# EAGLE design SERVICES_1 (EAGLE 6.5.0)

## Sheet 1 of 4
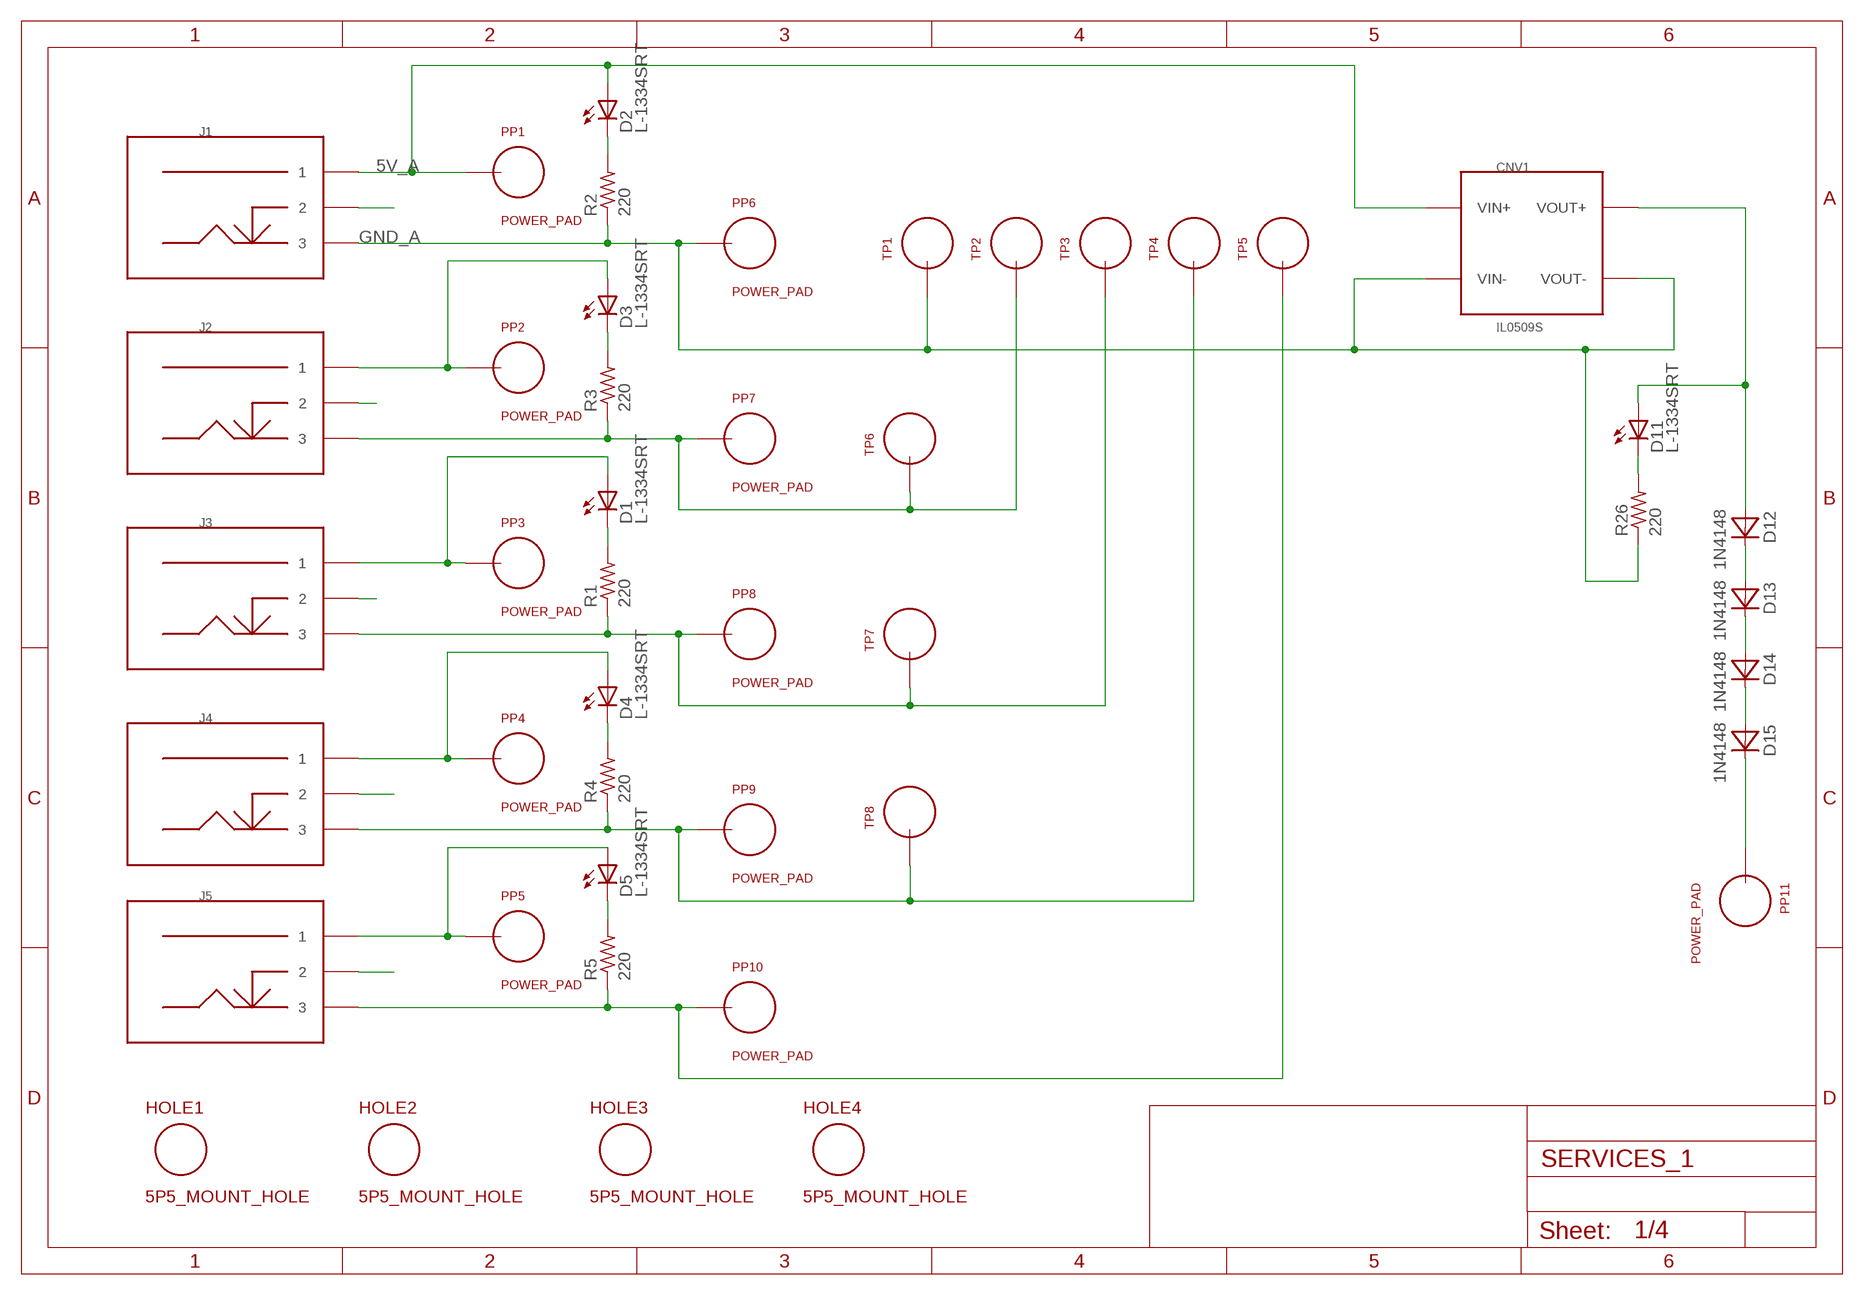
[diagram p0: schematic, sheet 1]

### Parts
CNV1  IL0509S  [SIL_IL]
D1  L-1334SRT  [LED3MM]
D2  L-1334SRT  [LED3MM]
D3  L-1334SRT  [LED3MM]
D4  L-1334SRT  [LED3MM]
D5  L-1334SRT  [LED3MM]
D11  L-1334SRT  [LED3MM]
D12  1N4148  [DO34-5]
D13  1N4148  [DO34-5]
D14  1N4148  [DO34-5]
D15  1N4148  [DO34-5]
HOLE1  5P5_MOUNT_HOLE  [5P5M_HOLE]
HOLE2  5P5_MOUNT_HOLE  [5P5M_HOLE]
HOLE3  5P5_MOUNT_HOLE  [5P5M_HOLE]
HOLE4  5P5_MOUNT_HOLE  [5P5M_HOLE]
J1  POWER_ENTRY  [POWER_25]
J2  POWER_ENTRY  [POWER_25]
J3  POWER_ENTRY  [POWER_25]
J4  POWER_ENTRY  [POWER_25]
J5  POWER_ENTRY  [POWER_25]
PP1  POWER_PAD  [POWER_PAD]
PP2  POWER_PAD  [POWER_PAD]
PP3  POWER_PAD  [POWER_PAD]
PP4  POWER_PAD  [POWER_PAD]
PP5  POWER_PAD  [POWER_PAD]
PP6  POWER_PAD  [POWER_PAD]
PP7  POWER_PAD  [POWER_PAD]
PP8  POWER_PAD  [POWER_PAD]
PP9  POWER_PAD  [POWER_PAD]
PP10  POWER_PAD  [POWER_PAD]
PP11  POWER_PAD  [POWER_PAD]
R1  220  R_P2INCH  [R_P2INCH]
R2  220  R_P2INCH  [R_P2INCH]
R3  220  R_P2INCH  [R_P2INCH]
R4  220  R_P2INCH  [R_P2INCH]
R5  220  R_P2INCH  [R_P2INCH]
R26  220  R_P2INCH  [R_P2INCH]
TP1  TEST_LOOP  [TEST_LOOP]
TP2  TEST_LOOP  [TEST_LOOP]
TP3  TEST_LOOP  [TEST_LOOP]
TP4  TEST_LOOP  [TEST_LOOP]
TP5  TEST_LOOP  [TEST_LOOP]
TP6  TEST_LOOP  [TEST_LOOP]
TP7  TEST_LOOP  [TEST_LOOP]
TP8  TEST_LOOP  [TEST_LOOP]

### Nets
5V_A: CNV1.VIN+ D2.A J1.1 PP1.1 ; also sheet 2
GND_A: CNV1.VIN- CNV1.VOUT- J1.3 PP6.1 R2.1 R26.1 TP1.P$1 ; also sheet 2,3,4
N$2: D3.A J2.1 PP2.1
N$3: D1.A J3.1 PP3.1
N$4: D4.A J4.1 PP4.1
N$5: D5.A J5.1 PP5.1
N$7: J2.3 PP7.1 R3.1 TP2.P$1 TP6.P$1
N$8: J3.3 PP8.1 R1.1 TP3.P$1 TP7.P$1
N$9: J4.3 PP9.1 R4.1 TP4.P$1 TP8.P$1
N$10: J5.3 PP10.1 R5.1 TP5.P$1
N$11: CNV1.VOUT+ D11.A D12.A
N$13: D1.K(C) R1.2
N$14: D2.K(C) R2.2
N$15: D3.K(C) R3.2
N$16: D4.K(C) R4.2
N$17: D5.K(C) R5.2
N$23: D11.K(C) R26.2
N$36: D12.C D13.A
N$37: J1.2
N$38: J2.2
N$39: J3.2
N$40: J4.2
N$41: J5.2
N$53: D13.C D14.A
N$70: D14.C D15.A
N$87: D15.C PP11.1

## Sheet 2 of 4
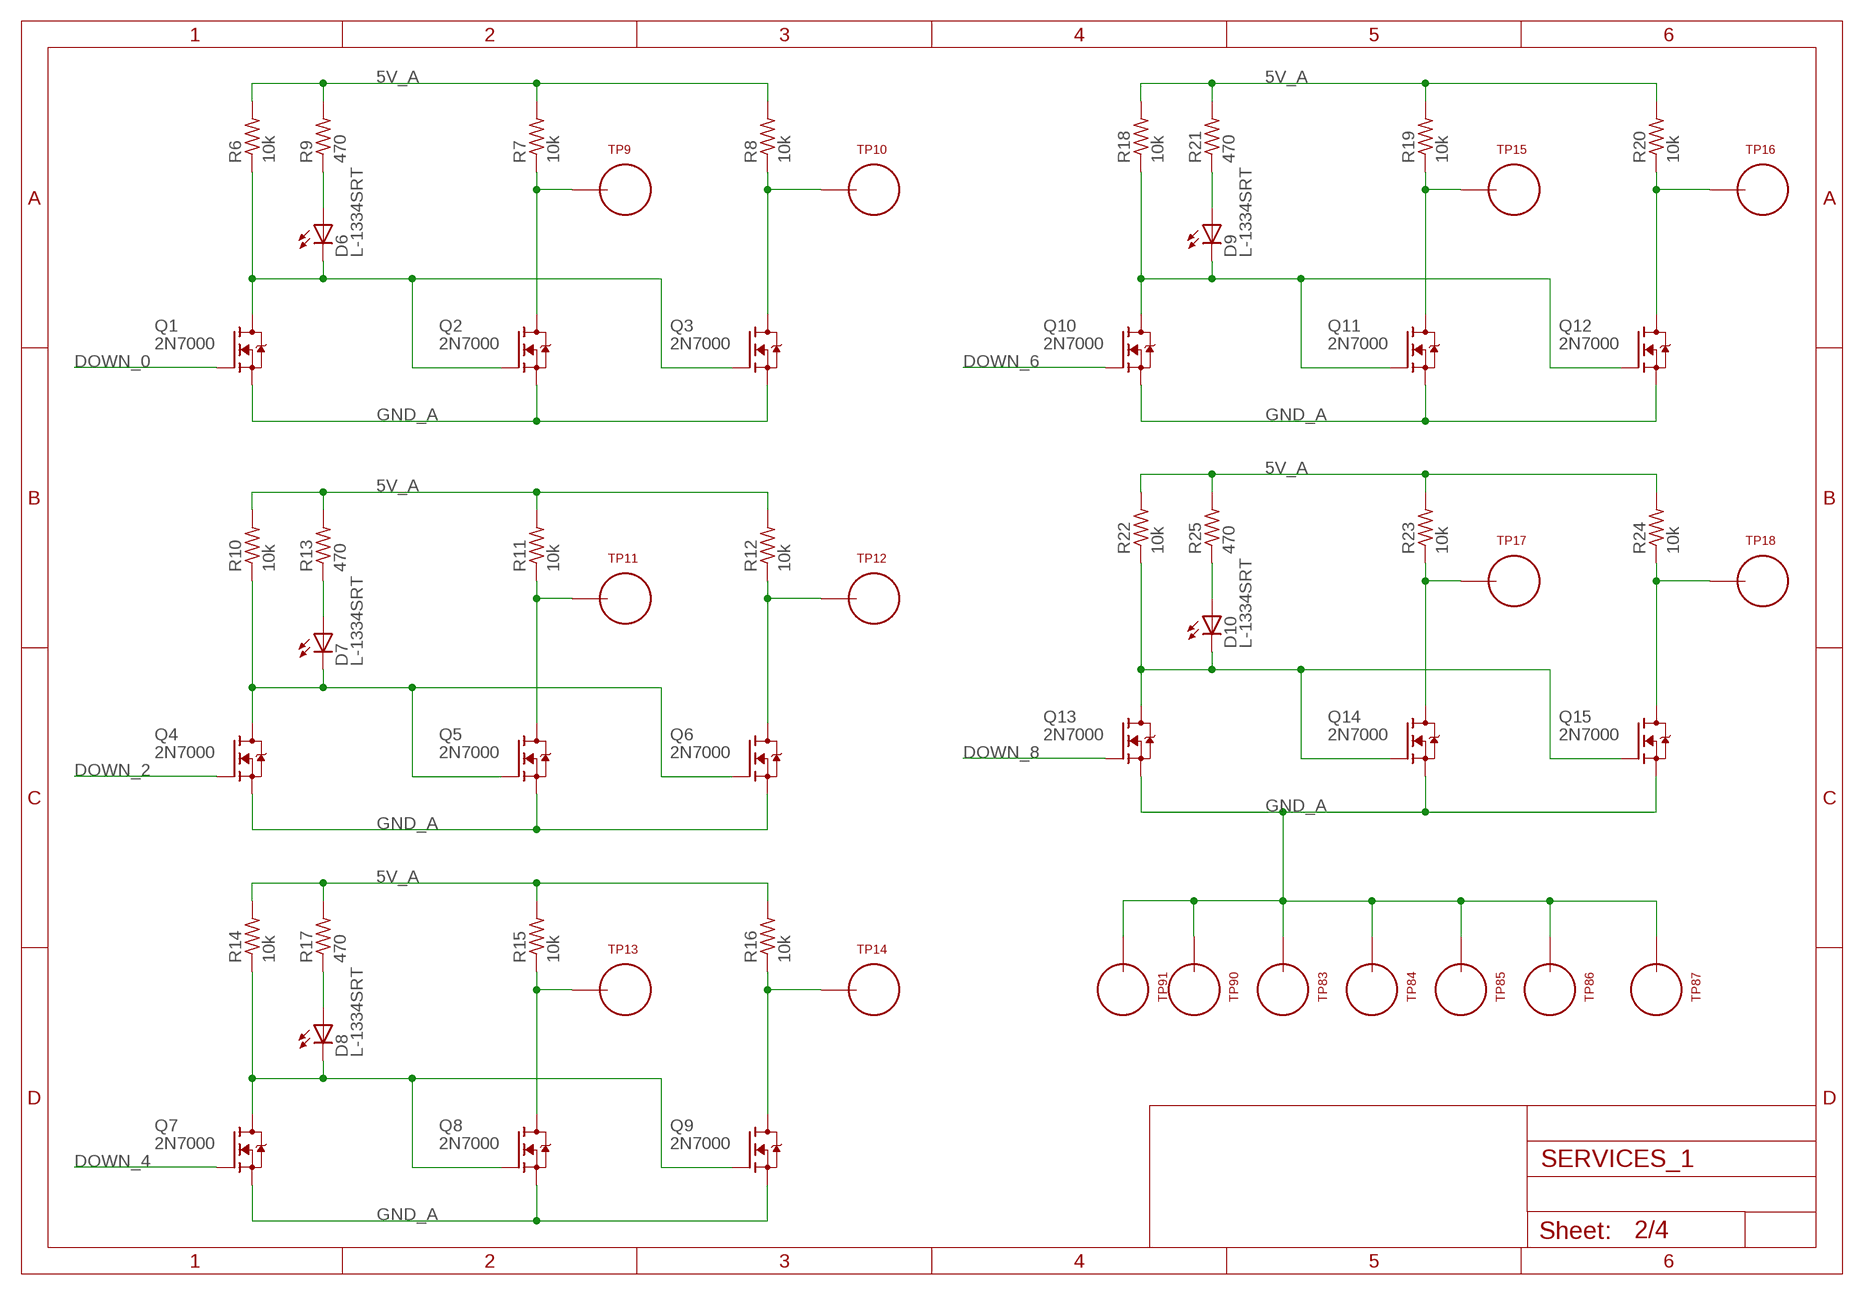
[diagram p1: schematic, sheet 2]

### Parts
D6  L-1334SRT  [LED3MM]
D7  L-1334SRT  [LED3MM]
D8  L-1334SRT  [LED3MM]
D9  L-1334SRT  [LED3MM]
D10  L-1334SRT  [LED3MM]
Q1  2N7000  [TO92-DGS]
Q2  2N7000  [TO92-DGS]
Q3  2N7000  [TO92-DGS]
Q4  2N7000  [TO92-DGS]
Q5  2N7000  [TO92-DGS]
Q6  2N7000  [TO92-DGS]
Q7  2N7000  [TO92-DGS]
Q8  2N7000  [TO92-DGS]
Q9  2N7000  [TO92-DGS]
Q10  2N7000  [TO92-DGS]
Q11  2N7000  [TO92-DGS]
Q12  2N7000  [TO92-DGS]
Q13  2N7000  [TO92-DGS]
Q14  2N7000  [TO92-DGS]
Q15  2N7000  [TO92-DGS]
R6  10k  R_P2INCH  [R_P2INCH]
R7  10k  R_P2INCH  [R_P2INCH]
R8  10k  R_P2INCH  [R_P2INCH]
R9  470  R_P2INCH  [R_P2INCH]
R10  10k  R_P2INCH  [R_P2INCH]
R11  10k  R_P2INCH  [R_P2INCH]
R12  10k  R_P2INCH  [R_P2INCH]
R13  470  R_P2INCH  [R_P2INCH]
R14  10k  R_P2INCH  [R_P2INCH]
R15  10k  R_P2INCH  [R_P2INCH]
R16  10k  R_P2INCH  [R_P2INCH]
R17  470  R_P2INCH  [R_P2INCH]
R18  10k  R_P2INCH  [R_P2INCH]
R19  10k  R_P2INCH  [R_P2INCH]
R20  10k  R_P2INCH  [R_P2INCH]
R21  470  R_P2INCH  [R_P2INCH]
R22  10k  R_P2INCH  [R_P2INCH]
R23  10k  R_P2INCH  [R_P2INCH]
R24  10k  R_P2INCH  [R_P2INCH]
R25  470  R_P2INCH  [R_P2INCH]
TP9  TEST_LOOP  [TEST_LOOP]
TP10  TEST_LOOP  [TEST_LOOP]
TP11  TEST_LOOP  [TEST_LOOP]
TP12  TEST_LOOP  [TEST_LOOP]
TP13  TEST_LOOP  [TEST_LOOP]
TP14  TEST_LOOP  [TEST_LOOP]
TP15  TEST_LOOP  [TEST_LOOP]
TP16  TEST_LOOP  [TEST_LOOP]
TP17  TEST_LOOP  [TEST_LOOP]
TP18  TEST_LOOP  [TEST_LOOP]
TP83  TEST_LOOP  [TEST_LOOP]
TP84  TEST_LOOP  [TEST_LOOP]
TP85  TEST_LOOP  [TEST_LOOP]
TP86  TEST_LOOP  [TEST_LOOP]
TP87  TEST_LOOP  [TEST_LOOP]
TP90  TEST_LOOP  [TEST_LOOP]
TP91  TEST_LOOP  [TEST_LOOP]

### Nets
5V_A: R6.2 R7.2 R8.2 R9.2 R10.2 R11.2 R12.2 R13.2 R14.2 R15.2 R16.2 R17.2 R18.2 R19.2 R20.2 R21.2 R22.2 R23.2 R24.2 R25.2 ; also sheet 1
DOWN_0: Q1.G ; also sheet 3
DOWN_2: Q4.G ; also sheet 3
DOWN_4: Q7.G ; also sheet 3
DOWN_6: Q10.G ; also sheet 3
DOWN_8: Q13.G ; also sheet 3
GND_A: Q1.S Q2.S Q3.S Q4.S Q5.S Q6.S Q7.S Q8.S Q9.S Q10.S Q11.S Q12.S Q13.S Q14.S Q15.S TP83.P$1 TP84.P$1 TP85.P$1 TP86.P$1 TP87.P$1 TP90.P$1 TP91.P$1 ; also sheet 1,3,4
N$1: D7.A R13.1
N$6: Q5.D R11.1 TP11.P$1
N$12: Q6.D R12.1 TP12.P$1
N$18: D6.A R9.1
N$19: Q2.D R7.1 TP9.P$1
N$20: Q3.D R8.1 TP10.P$1
N$21: D6.K(C) Q1.D Q2.G Q3.G R6.1
N$22: D7.K(C) Q4.D Q5.G Q6.G R10.1
N$24: D8.A R17.1
N$25: Q8.D R15.1 TP13.P$1
N$26: Q9.D R16.1 TP14.P$1
N$27: D8.K(C) Q7.D Q8.G Q9.G R14.1
N$28: D9.A R21.1
N$29: Q11.D R19.1 TP15.P$1
N$30: Q12.D R20.1 TP16.P$1
N$31: D9.K(C) Q10.D Q11.G Q12.G R18.1
N$32: D10.A R25.1
N$33: Q14.D R23.1 TP17.P$1
N$34: Q15.D R24.1 TP18.P$1
N$35: D10.K(C) Q13.D Q14.G Q15.G R22.1

## Sheet 3 of 4
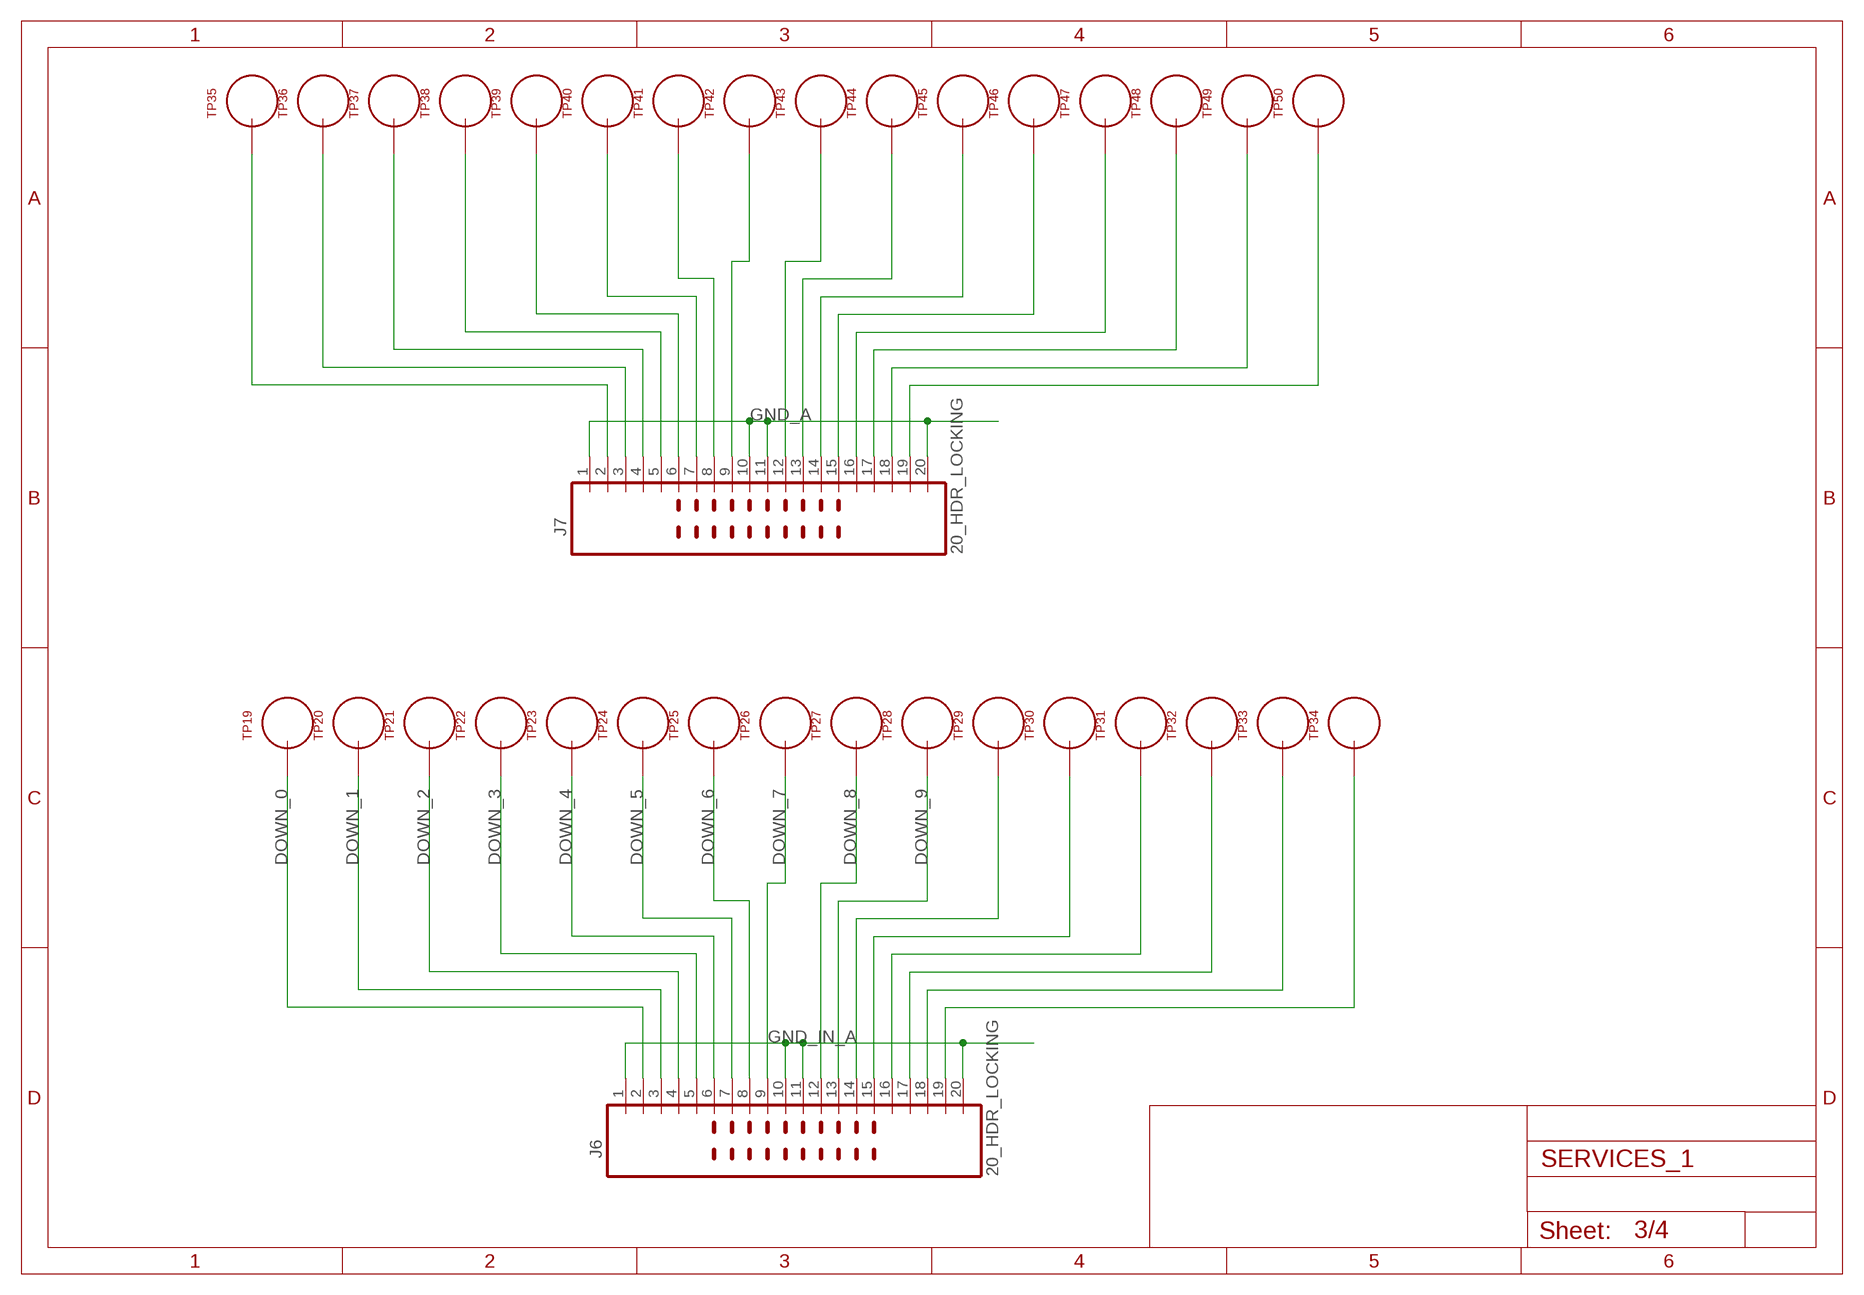
[diagram p2: schematic, sheet 3]

### Parts
J6  20_HDR_LOCKING  [20_HDR_LOCKING]
J7  20_HDR_LOCKING  [20_HDR_LOCKING]
TP19  TEST_LOOP  [TEST_LOOP]
TP20  TEST_LOOP  [TEST_LOOP]
TP21  TEST_LOOP  [TEST_LOOP]
TP22  TEST_LOOP  [TEST_LOOP]
TP23  TEST_LOOP  [TEST_LOOP]
TP24  TEST_LOOP  [TEST_LOOP]
TP25  TEST_LOOP  [TEST_LOOP]
TP26  TEST_LOOP  [TEST_LOOP]
TP27  TEST_LOOP  [TEST_LOOP]
TP28  TEST_LOOP  [TEST_LOOP]
TP29  TEST_LOOP  [TEST_LOOP]
TP30  TEST_LOOP  [TEST_LOOP]
TP31  TEST_LOOP  [TEST_LOOP]
TP32  TEST_LOOP  [TEST_LOOP]
TP33  TEST_LOOP  [TEST_LOOP]
TP34  TEST_LOOP  [TEST_LOOP]
TP35  TEST_LOOP  [TEST_LOOP]
TP36  TEST_LOOP  [TEST_LOOP]
TP37  TEST_LOOP  [TEST_LOOP]
TP38  TEST_LOOP  [TEST_LOOP]
TP39  TEST_LOOP  [TEST_LOOP]
TP40  TEST_LOOP  [TEST_LOOP]
TP41  TEST_LOOP  [TEST_LOOP]
TP42  TEST_LOOP  [TEST_LOOP]
TP43  TEST_LOOP  [TEST_LOOP]
TP44  TEST_LOOP  [TEST_LOOP]
TP45  TEST_LOOP  [TEST_LOOP]
TP46  TEST_LOOP  [TEST_LOOP]
TP47  TEST_LOOP  [TEST_LOOP]
TP48  TEST_LOOP  [TEST_LOOP]
TP49  TEST_LOOP  [TEST_LOOP]
TP50  TEST_LOOP  [TEST_LOOP]

### Nets
DOWN_0: J6.2 TP19.P$1 ; also sheet 2
DOWN_1: J6.3 TP20.P$1
DOWN_2: J6.4 TP21.P$1 ; also sheet 2
DOWN_3: J6.5 TP22.P$1
DOWN_4: J6.6 TP23.P$1 ; also sheet 2
DOWN_5: J6.7 TP24.P$1
DOWN_6: J6.8 TP25.P$1 ; also sheet 2
DOWN_7: J6.9 TP26.P$1
DOWN_8: J6.12 TP27.P$1 ; also sheet 2
DOWN_9: J6.13 TP28.P$1
GND_A: J7.1 J7.10 J7.11 J7.20 ; also sheet 1,2,4
GND_IN_A: J6.1 J6.10 J6.11 J6.20
N$44: J6.19 TP34.P$1
N$45: J6.18 TP33.P$1
N$46: J6.17 TP32.P$1
N$47: J6.16 TP31.P$1
N$48: J6.15 TP30.P$1
N$49: J6.14 TP29.P$1
N$54: J7.2 TP35.P$1
N$55: J7.3 TP36.P$1
N$56: J7.4 TP37.P$1
N$57: J7.5 TP38.P$1
N$58: J7.6 TP39.P$1
N$59: J7.7 TP40.P$1
N$60: J7.8 TP41.P$1
N$61: J7.19 TP50.P$1
N$62: J7.18 TP49.P$1
N$63: J7.17 TP48.P$1
N$64: J7.16 TP47.P$1
N$65: J7.15 TP46.P$1
N$66: J7.14 TP45.P$1
N$67: J7.13 TP44.P$1
N$68: J7.12 TP43.P$1
N$69: J7.9 TP42.P$1

## Sheet 4 of 4
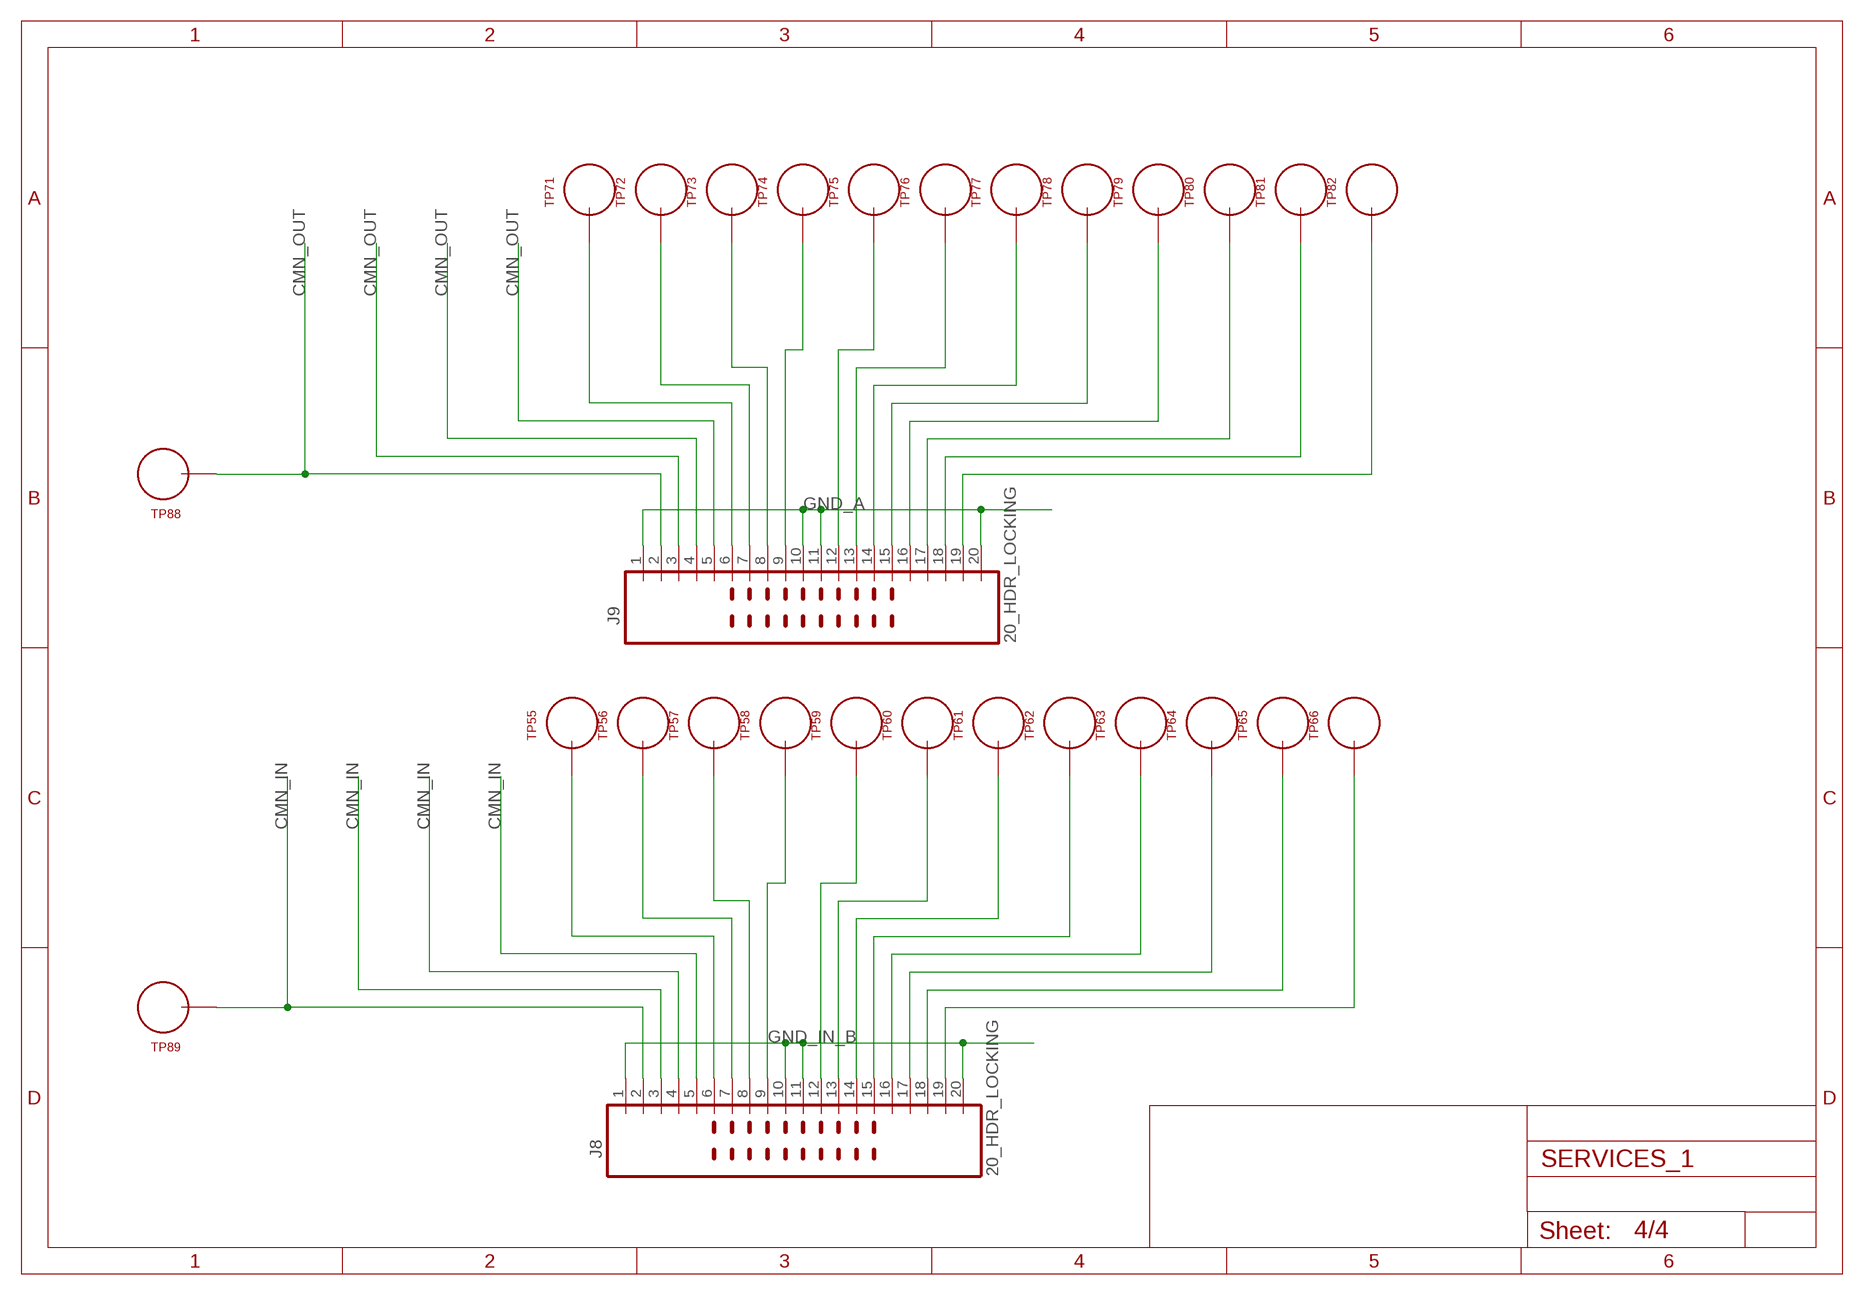
[diagram p3: schematic, sheet 4]

### Parts
J8  20_HDR_LOCKING  [20_HDR_LOCKING]
J9  20_HDR_LOCKING  [20_HDR_LOCKING]
TP55  TEST_LOOP  [TEST_LOOP]
TP56  TEST_LOOP  [TEST_LOOP]
TP57  TEST_LOOP  [TEST_LOOP]
TP58  TEST_LOOP  [TEST_LOOP]
TP59  TEST_LOOP  [TEST_LOOP]
TP60  TEST_LOOP  [TEST_LOOP]
TP61  TEST_LOOP  [TEST_LOOP]
TP62  TEST_LOOP  [TEST_LOOP]
TP63  TEST_LOOP  [TEST_LOOP]
TP64  TEST_LOOP  [TEST_LOOP]
TP65  TEST_LOOP  [TEST_LOOP]
TP66  TEST_LOOP  [TEST_LOOP]
TP71  TEST_LOOP  [TEST_LOOP]
TP72  TEST_LOOP  [TEST_LOOP]
TP73  TEST_LOOP  [TEST_LOOP]
TP74  TEST_LOOP  [TEST_LOOP]
TP75  TEST_LOOP  [TEST_LOOP]
TP76  TEST_LOOP  [TEST_LOOP]
TP77  TEST_LOOP  [TEST_LOOP]
TP78  TEST_LOOP  [TEST_LOOP]
TP79  TEST_LOOP  [TEST_LOOP]
TP80  TEST_LOOP  [TEST_LOOP]
TP81  TEST_LOOP  [TEST_LOOP]
TP82  TEST_LOOP  [TEST_LOOP]
TP88  TEST_LOOP  [TEST_LOOP]
TP89  TEST_LOOP  [TEST_LOOP]

### Nets
CMN_IN: J8.2 J8.3 J8.4 J8.5 TP89.P$1
CMN_OUT: J9.2 J9.3 J9.4 J9.5 TP88.P$1
GND_A: J9.1 J9.10 J9.11 J9.20 ; also sheet 1,2,3
GND_IN_B: J8.1 J8.10 J8.11 J8.20
N$75: J8.6 TP55.P$1
N$76: J8.7 TP56.P$1
N$77: J8.8 TP57.P$1
N$78: J8.19 TP66.P$1
N$79: J8.18 TP65.P$1
N$80: J8.17 TP64.P$1
N$81: J8.16 TP63.P$1
N$82: J8.15 TP62.P$1
N$83: J8.14 TP61.P$1
N$84: J8.13 TP60.P$1
N$85: J8.12 TP59.P$1
N$86: J8.9 TP58.P$1
N$92: J9.6 TP71.P$1
N$93: J9.7 TP72.P$1
N$94: J9.8 TP73.P$1
N$95: J9.19 TP82.P$1
N$96: J9.18 TP81.P$1
N$97: J9.17 TP80.P$1
N$98: J9.16 TP79.P$1
N$99: J9.15 TP78.P$1
N$100: J9.14 TP77.P$1
N$101: J9.13 TP76.P$1
N$102: J9.12 TP75.P$1
N$103: J9.9 TP74.P$1

## Library data of the parts
CNV1 = MyLib:IL0509S
D1-D11 = MyLib:L-1334SRT
D12-D15 = james:1N4148
HOLE1-HOLE4 = MyLib:5P5_MOUNT_HOLE
J1-J5 = MyLib:POWER_ENTRY
J6-J9 = MyLib:20_HDR_LOCKING
PP1-PP11 = MyLib:POWER_PAD
Q1-Q15 = MyLib:2N7000
R1-R26 = MyLib:R_P2INCH
TP1-TP50 TP55-TP66 TP71-TP91 = MyLib:TEST_LOOP

## Board
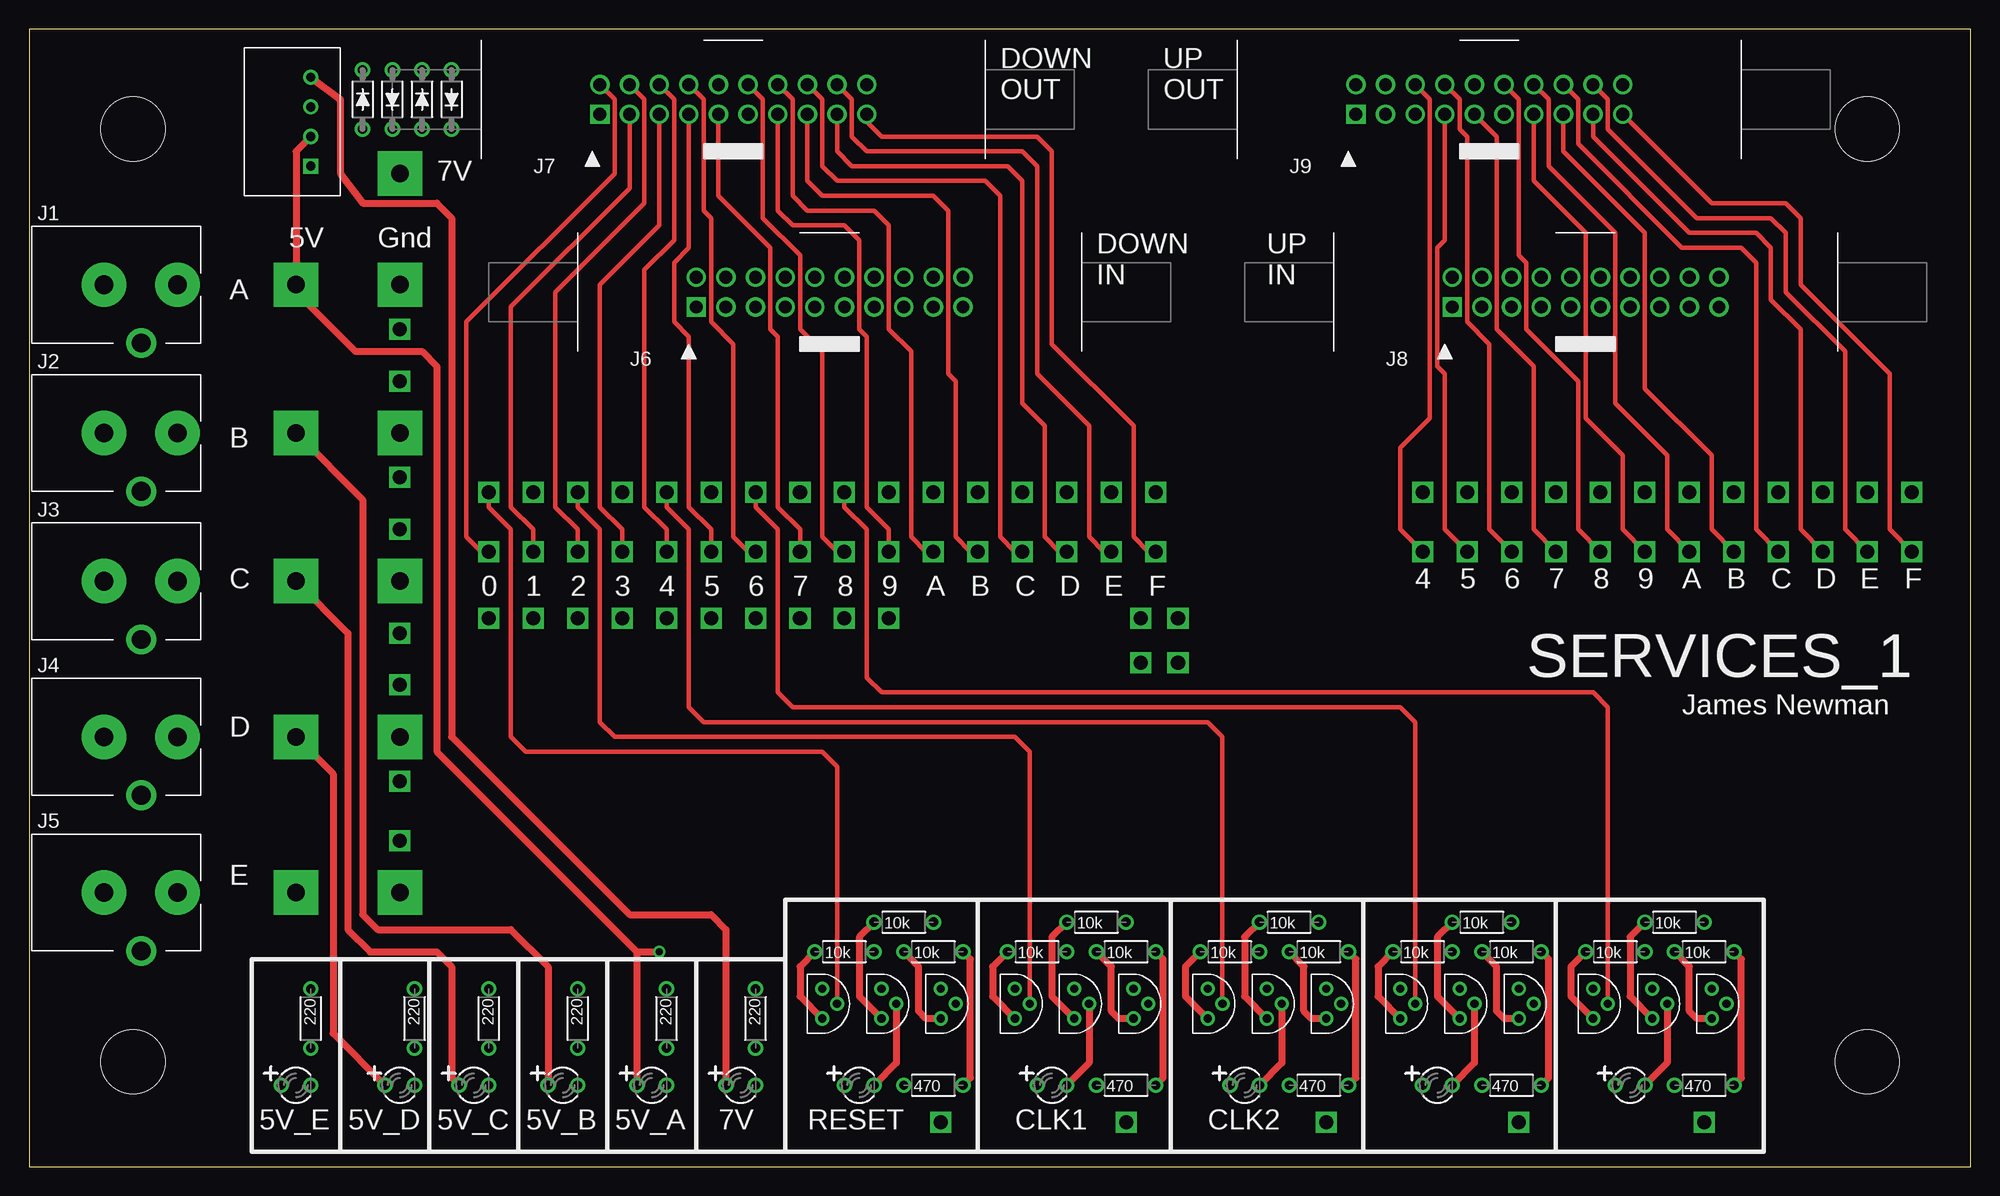
[diagram p4: board, top side]
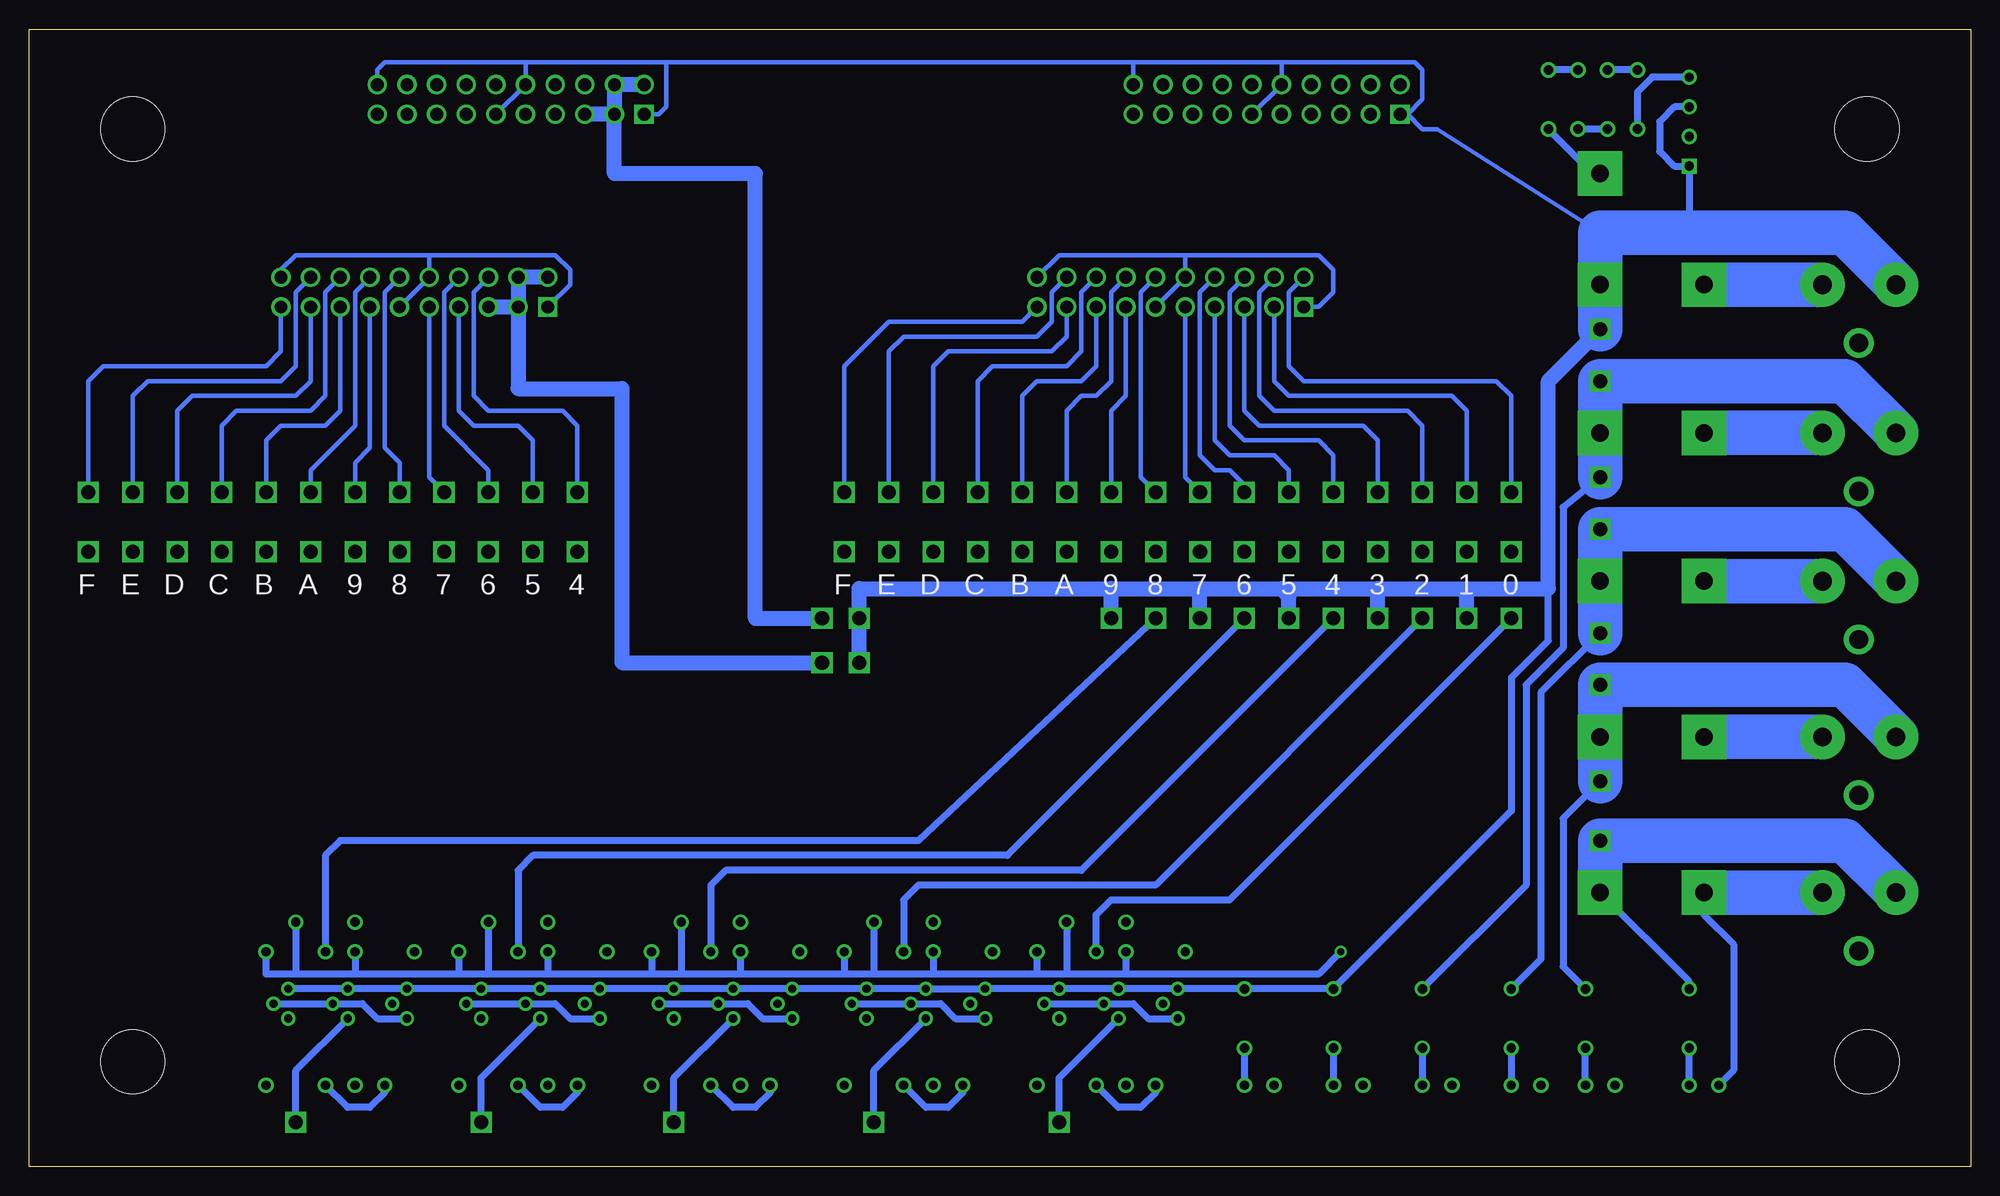
[diagram p5: board, bottom side, seen from below]

Size 166.35 x 97.46 mm. Coordinates in mm from the lower left corner, seen from the top.
Outline: 0,0 166.35,0 166.35,97.46 0,97.46 0,0
Copper layers (1*16): Top 0.035mm / dielectric 1.5mm / Bottom 0.035mm
Design rules "processor_rules_2layer": minimum track width 8mil, minimum drill 14mil, track to track 8mil, track to pad 8mil, pad to pad 8mil, via to via 8mil, smd to smd 8mil, copper to edge 40mil, drill to drill 8mil, minimum pad ring 10mil, minimum via ring 8mil, stop-mask expansion 4mil, vias tented up to drill 0.7mm, thermal gap 10mil

### Footprints (pad centres in the part's own frame; a part is rotated, then mirrored left to right if it is on the bottom)
SIL_IL = drill 0.8: VIN+ -1.27,-2.54; VOUT+ 3.81,-2.54; VOUT- 1.27,-2.54 | drill 0.8 square: VIN- -3.81,-2.54
LED3MM = drill 0.8: A -1.27,0; K 1.27,0
DO34-5 = drill 0.813: A 2.54,0; C -2.54,0
5P5M_HOLE = hole 5.5: 0,0
POWER_25 = drill 1.6 pad 3.81: 1 0,0; 3 -6.3,0 | drill 1.6 pad 2.54: 2 -3.1,-5
20_HDR_LOCKING = drill 1.1 square: 1 -1.27,11.43 | drill 1.1: 2 1.27,11.43; 3 -1.27,8.89; 4 1.27,8.89; 5 -1.27,6.35; 6 1.27,6.35; 7 -1.27,3.81; 8 1.27,3.81; 9 -1.27,1.27; 10 1.27,1.27; 11 -1.27,-1.27; 12 1.27,-1.27; 13 -1.27,-3.81; 14 1.27,-3.81; 15 -1.27,-6.35; 16 1.27,-6.35; 17 -1.27,-8.89; 18 1.27,-8.89; 19 -1.27,-11.43; 20 1.27,-11.43
POWER_PAD = drill 1.5 pad 3.81 square: 1 0,0
TO92-DGS = drill 0.7: D 0,1.27; G -1.27,0; S 0,-1.27
R_P2INCH = drill 0.8: 1 -2.54,0; 2 2.54,0
TEST_LOOP = drill 1.2 square: P$1 0,0

### Placement (x,y rotation side)
CNV1  21.59,89.53 90 top
D1  38.1,6.99 0 top
D2  53.34,6.99 0 top
D3  45.72,6.99 0 top
D4  31.75,6.99 0 top
D5  22.86,6.99 0 top
D6  71.12,6.99 0 top
D7  87.63,6.99 0 top
D8  104.14,6.99 0 top
D9  120.65,6.99 0 top
D10  137.16,6.99 0 top
D11  60.96,6.99 0 top
D12  28.57,91.44 270 top
D13  31.11,91.44 90 top
D14  33.66,91.44 270 top
D15  36.2,91.44 90 top
HOLE1  157.48,88.9 0 top
HOLE2  157.48,8.99 0 top
HOLE3  8.89,8.99 0 top
HOLE4  8.89,88.9 0 top
J1  12.7,75.56 0 top
J2  12.7,62.87 0 top
J3  12.7,50.16 0 top
J4  12.7,36.83 0 top
J5  12.7,23.5 0 top
J6  68.58,74.93 90 top
J7  60.33,91.44 90 top
J8  133.35,74.93 90 top
J9  125.09,91.44 90 top
PP1  22.86,75.56 270 top
PP2  22.86,62.87 270 top
PP3  22.86,50.16 270 top
PP4  22.86,36.83 270 top
PP5  22.86,23.5 270 top
PP6  31.75,75.56 270 top
PP7  31.75,62.87 270 top
PP8  31.75,50.16 270 top
PP9  31.75,36.83 270 top
PP10  31.75,23.5 270 top
PP11  31.75,85.09 270 top
Q1  67.94,13.97 180 top
Q2  73.03,13.97 180 top
Q3  78.11,13.97 180 top
Q4  84.45,13.97 180 top
Q5  89.53,13.97 180 top
Q6  94.61,13.97 180 top
Q7  100.97,13.97 180 top
Q8  106.05,13.97 180 top
Q9  111.12,13.97 180 top
Q10  117.47,13.97 180 top
Q11  122.56,13.97 180 top
Q12  127.64,13.97 180 top
Q13  133.99,13.97 180 top
Q14  139.06,13.97 180 top
Q15  144.15,13.97 180 top
R1  39.37,12.7 270 top
R2  54.61,12.7 270 top
R3  46.99,12.7 270 top
R4  33.02,12.7 270 top
R5  24.13,12.7 270 top
R6  69.85,18.41 0 top
R7  74.93,20.95 0 top
R8  77.47,18.41 0 top
R9  77.47,6.99 0 top
R10  86.36,18.41 0 top
R11  91.44,20.95 0 top
R12  93.98,18.41 0 top
R13  93.98,6.99 0 top
R14  102.87,18.41 0 top
R15  107.95,20.95 0 top
R16  110.49,18.41 0 top
R17  110.49,6.99 0 top
R18  119.38,18.41 0 top
R19  124.46,20.95 0 top
R20  127,18.41 0 top
R21  127,6.99 0 top
R22  135.89,18.41 0 top
R23  140.97,20.95 0 top
R24  143.51,18.41 0 top
R25  143.51,6.99 0 top
R26  62.23,12.7 270 top
TP1  31.75,71.75 90 top
TP2  31.75,59.05 90 top
TP3  31.75,54.61 90 top
TP4  31.75,33.02 90 top
TP5  31.75,27.94 90 top
TP6  31.75,67.31 90 top
TP7  31.75,45.72 90 top
TP8  31.75,41.27 90 top
TP9  78.11,3.81 0 top
TP10  39.37,46.99 0 top
TP11  93.98,3.81 0 top
TP12  46.99,46.99 0 top
TP13  111.12,3.81 0 top
TP14  54.61,46.99 0 top
TP15  127.64,3.81 0 top
TP16  62.23,46.99 0 top
TP17  143.51,3.81 0 top
TP18  69.85,46.99 0 top
TP19  39.37,57.78 0 top
TP20  43.18,57.78 0 top
TP21  46.99,57.78 0 top
TP22  50.8,57.78 0 top
TP23  54.61,57.78 0 top
TP24  58.42,57.78 0 top
TP25  62.23,57.78 0 top
TP26  66.04,57.78 0 top
TP27  69.85,57.78 0 top
TP28  73.66,57.78 0 top
TP29  77.47,57.78 0 top
TP30  81.28,57.78 0 top
TP31  85.09,57.78 0 top
TP32  88.9,57.78 0 top
TP33  92.71,57.78 0 top
TP34  96.52,57.78 0 top
TP35  39.37,52.7 0 top
TP36  43.18,52.7 0 top
TP37  46.99,52.7 0 top
TP38  50.8,52.7 0 top
TP39  54.61,52.7 0 top
TP40  58.42,52.7 0 top
TP41  62.23,52.7 0 top
TP42  66.04,52.7 0 top
TP43  69.85,52.7 0 top
TP44  73.66,52.7 0 top
TP45  77.47,52.7 0 top
TP46  81.28,52.7 0 top
TP47  85.09,52.7 0 top
TP48  88.9,52.7 0 top
TP49  92.71,52.7 0 top
TP50  96.52,52.7 0 top
TP55  119.38,57.78 0 top
TP56  123.19,57.78 0 top
TP57  127,57.78 0 top
TP58  130.81,57.78 0 top
TP59  134.62,57.78 0 top
TP60  138.43,57.78 0 top
TP61  142.24,57.78 0 top
TP62  146.05,57.78 0 top
TP63  149.86,57.78 0 top
TP64  153.67,57.78 0 top
TP65  157.48,57.78 0 top
TP66  161.29,57.78 0 top
TP71  119.38,52.7 0 top
TP72  123.19,52.7 0 top
TP73  127,52.7 0 top
TP74  130.81,52.7 0 top
TP75  134.62,52.7 0 top
TP76  138.43,52.7 0 top
TP77  142.24,52.7 0 top
TP78  146.05,52.7 0 top
TP79  149.86,52.7 0 top
TP80  153.67,52.7 0 top
TP81  157.48,52.7 0 top
TP82  161.29,52.7 270 top
TP83  43.18,46.99 0 top
TP84  50.8,46.99 0 top
TP85  58.42,46.99 0 top
TP86  66.04,46.99 0 top
TP87  73.66,46.99 0 top
TP88  98.42,46.99 0 top
TP89  98.42,43.18 0 top
TP90  95.25,46.99 0 top
TP91  95.25,43.18 0 top

### Tracks (layer width: path | path; a pad name or v marks a point on that pad's centre or on a via)
5V_A  (via drill 0.6)
  Top 0.61: CNV1.VIN+ 22.86,87 PP1.1 22.86,74.93 27.94,69.85 33.66,69.85 34.92,68.58 34.92,35.56 52.07,18.41 | 52.07,18.41 D2.A | R9.2 80.64,7.62 80.64,17.78 R8.2 | R13.2 97.16,7.62 97.16,17.78 R12.2 | R25.2 146.69,7.62 146.69,17.78 R24.2 | R21.2 130.18,7.62 130.18,17.78 R20.2 | R17.2 113.67,7.62 113.67,17.78 R16.2 | 52.07,18.41 v53.98,18.41
  Bottom 0.61: R8.2 80.01,16.51 | 80.01,16.51 88.9,16.51 | 88.9,16.51 93.98,16.51 | 93.98,16.51 96.52,16.51 | 96.52,16.51 105.41,16.51 | 105.41,16.51 110.49,16.51 | 110.49,16.51 113.03,16.51 | 113.03,16.51 121.92,16.51 | 121.92,16.51 127,16.51 | 127,16.51 129.54,16.51 | 129.54,16.51 138.43,16.51 | 138.43,16.51 143.51,16.51 | 143.51,16.51 146.05,16.51 R24.2 | R22.2 138.43,16.51 | R20.2 129.54,16.51 | R23.2 143.51,16.51 | R19.2 127,16.51 | R18.2 121.92,16.51 | R16.2 113.03,16.51 | R15.2 110.49,16.51 | R14.2 105.41,16.51 | R12.2 96.52,16.51 | R11.2 93.98,16.51 | R10.2 88.9,16.51 | R6.2 72.39,16.51 | 72.39,16.51 77.47,16.51 | 77.47,16.51 80.01,16.51 | R7.2 77.47,16.51 | v53.98,18.41 55.88,16.51 72.39,16.51
  Bottom 3.81: J1.1 PP1.1
CMN_IN
  Bottom 1.27: J8.2 J8.4 J8.3 | J8.5 J8.3 | J8.3 124.46,66.67 115.57,66.67 115.57,43.18 TP89.P$1
CMN_OUT
  Bottom 1.27: TP88.P$1 104.14,46.99 104.14,85.09 116.2,85.09 J9.3 | J9.2 J9.4 J9.3 | J9.3 J9.5
DOWN_0
  Top 0.406: TP19.P$1 39.37,56.52 41.27,54.61 41.27,36.83 42.55,35.56 67.94,35.56 69.22,34.29 Q1.G
  Bottom 0.406: J6.2 58.42,74.93 58.42,68.58 57.15,67.31 40.64,67.31 39.37,66.04 TP19.P$1
DOWN_1
  Bottom 0.406: J6.3 59.69,67.31 58.42,66.04 44.45,66.04 43.18,64.77 TP20.P$1
DOWN_2
  Top 0.406: TP21.P$1 46.99,56.52 48.9,54.61 48.9,38.1 50.16,36.83 84.45,36.83 85.72,35.56 Q4.G
  Bottom 0.406: J6.4 60.96,74.93 60.96,66.04 59.69,64.77 48.26,64.77 46.99,63.5 TP21.P$1
DOWN_3
  Bottom 0.406: J6.5 62.23,64.77 60.96,63.5 52.07,63.5 50.8,62.23 TP22.P$1
DOWN_4
  Top 0.406: TP23.P$1 54.61,56.52 56.52,54.61 56.52,39.37 57.78,38.1 100.97,38.1 102.23,36.83 Q7.G
  Bottom 0.406: J6.6 63.5,74.93 63.5,63.5 62.23,62.23 55.88,62.23 54.61,60.96 TP23.P$1
DOWN_5
  Bottom 0.406: J6.7 64.77,62.23 63.5,60.96 59.69,60.96 58.42,59.69 TP24.P$1
DOWN_6
  Top 0.406: Q10.G 118.75,38.1 117.47,39.37 65.41,39.37 64.14,40.64 64.14,54.61 62.23,56.52 TP25.P$1
  Bottom 0.406: J6.8 66.04,74.93 66.04,60.96 64.77,59.69 63.5,59.69 62.23,58.42 TP25.P$1
DOWN_7
  Bottom 0.406: J6.9 67.31,59.05 TP26.P$1
DOWN_8
  Top 0.406: Q13.G 135.25,39.37 133.99,40.64 73.03,40.64 71.75,41.91 71.75,54.61 69.85,56.52 TP27.P$1
  Bottom 0.406: J6.12 71.12,74.93 71.12,59.05 TP27.P$1
DOWN_9
  Bottom 0.406: J6.13 72.39,66.04 73.66,64.77 TP28.P$1
GND_A
  Bottom 0.406: J7.11 J7.10 59.05,94.61 | J7.20 71.75,94.61 | 71.75,94.61 59.05,94.61 | J7.1 48.26,90.17 | 48.26,90.17 46.99,91.44 46.99,93.98 47.62,94.61 59.05,94.61 | J9.11 J9.10 123.83,94.61 | 123.83,94.61 135.89,94.61 136.53,93.98 J9.20 | J9.1 112.39,90.17 111.76,90.81 111.76,94.61 | 111.76,94.61 123.83,94.61 | 31.75,80.01 45.72,88.9 46.99,88.9 48.26,90.17 | 71.75,94.61 111.76,94.61
  Bottom 0.61: 24.13,80.01 CNV1.VIN- 25.4,85.72 26.67,87 26.67,89.53 25.4,90.81 CNV1.VOUT- | Q15.S Q14.S Q13.S Q12.S Q11.S Q10.S Q9.S Q8.S Q7.S Q6.S Q5.S Q4.S Q3.S Q2.S Q1.S R26.1 R2.1 39.37,30.48 39.37,41.91 36.2,45.09 36.2,49.53
  Bottom 1.27: TP87.P$1 73.66,49.53 | 73.66,49.53 66.04,49.53 | 66.04,49.53 59.05,49.53 | 59.05,49.53 50.8,49.53 | 50.8,49.53 43.18,49.53 | 43.18,49.53 36.2,49.53 36.2,67.31 TP1.P$1 | TP83.P$1 43.18,49.53 | TP84.P$1 50.8,49.53 | TP85.P$1 58.42,48.9 59.05,49.53 | TP86.P$1 66.04,49.53 | TP91.P$1 TP90.P$1 95.25,49.53 73.66,49.53
  Bottom 3.81: J1.3 6.4,75.61 10.79,80.01 24.13,80.01 31.75,80.01 PP6.1 TP1.P$1
GND_IN_A
  Bottom 0.406: J6.1 55.88,73.66 54.61,74.93 54.61,76.83 55.88,78.11 67.31,78.11 | 67.31,78.11 78.11,78.11 J6.20 | 67.31,78.11 J6.10 J6.11
GND_IN_B
  Bottom 0.406: J8.20 144.78,76.83 143.51,78.11 132.08,78.11 | 132.08,78.11 121.28,78.11 120.02,76.83 120.02,75.56 J8.1 | 132.08,78.11 J8.10 J8.11
N$1
  Bottom 0.61: D7.A 86.36,6.35 87.63,5.08 89.53,5.08 R13.1
N$2
  Top 0.61: PP2.1 28.57,57.15 28.57,21.59 29.84,20.32 41.27,20.32 44.45,17.14 D3.A
  Bottom 3.81: J2.1 PP2.1
N$3
  Top 0.61: PP3.1 27.3,45.72 27.3,20.32 29.21,18.41 34.92,18.41 36.2,17.14 36.2,7.62 D1.A
  Bottom 3.81: J3.1 PP3.1
N$4
  Top 0.61: PP4.1 26.04,33.66 26.04,11.43 D4.A
  Bottom 3.81: J4.1 PP4.1
N$5
  Bottom 0.61: PP5.1 22.86,21.59 20.32,19.05 20.32,8.26 D5.A
  Bottom 3.81: J5.1 PP5.1
N$6
  Top 0.61: R11.1 87.63,19.68 87.63,14.61 Q5.D
  Bottom 0.61: TP11.P$1 93.98,8.26 Q5.D
N$7
  Bottom 0.61: TP2.P$1 34.92,56.52 34.92,44.45 38.1,41.27 38.1,24.13 R3.1
  Bottom 3.81: J2.3 6.4,62.91 10.79,67.31 TP6.P$1 PP7.1 TP2.P$1
N$8
  Bottom 0.61: TP7.P$1 36.83,40.64 36.83,17.78 R1.1
  Bottom 3.81: J3.3 6.4,50.22 10.79,54.61 TP3.P$1 PP8.1 TP7.P$1
N$9
  Bottom 0.61: TP4.P$1 34.92,29.84 34.92,17.14 R4.1
  Bottom 3.81: J4.3 6.4,36.88 10.79,41.27 TP8.P$1 PP9.1 TP4.P$1
N$10
  Bottom 0.61: R5.1 24.13,15.88 PP10.1
  Bottom 3.81: J5.3 6.4,23.55 10.79,27.94 TP5.P$1 PP10.1
N$11
  Top 0.61: CNV1.VOUT+ 26.67,91.44 26.67,85.09 28.57,82.55 34.92,82.55 36.2,81.28 36.2,36.83 51.44,21.59 58.42,21.59 59.69,20.32 D11.A
  Bottom 0.61: CNV1.VOUT+ 27.3,93.34 28.57,92.08 D12.A
N$12
  Top 0.61: Q6.D 93.34,12.7 92.71,13.34 92.71,17.14 R12.1
  Bottom 0.61: TP12.P$1 69.85,24.13 90.17,24.13 91.44,22.86 R12.1
N$13
  Bottom 0.61: R1.2 D1.K
N$14
  Bottom 0.61: R2.2 D2.K
N$15
  Bottom 0.61: R3.2 D3.K
N$16
  Bottom 0.61: D4.K R4.2
N$17
  Bottom 0.61: D5.K R5.2
N$18
  Bottom 0.61: D6.A 69.85,6.35 71.12,5.08 73.03,5.08 R9.1
N$19
  Top 0.61: R7.1 71.12,19.68 71.12,14.61 Q2.D
  Bottom 0.61: TP9.P$1 78.11,7.62 Q2.D
N$20
  Top 0.61: Q3.D 76.83,12.7 76.2,13.34 76.2,17.14 R8.1
  Bottom 0.61: R8.1 74.93,21.59 73.66,22.86 63.5,22.86 TP10.P$1
N$21
  Top 0.61: Q2.G 74.3,8.89 D6.K | R6.1 66.04,17.14 66.04,14.61 Q1.D
  Bottom 0.61: Q3.G Q2.G 71.75,13.97 70.48,12.7 Q1.D
N$22
  Top 0.61: Q5.G 90.81,8.89 D7.K | R10.1 82.55,17.14 82.55,14.61 Q4.D
  Bottom 0.61: Q6.G Q5.G 88.27,13.97 87,12.7 Q4.D
N$23
  Bottom 0.61: R26.2 D11.K
N$24
  Bottom 0.61: D8.A 102.87,6.35 104.14,5.08 106.05,5.08 R17.1
N$25
  Top 0.61: R15.1 104.14,19.68 104.14,14.61 Q8.D
  Bottom 0.61: TP13.P$1 111.12,7.62 Q8.D
N$26
  Top 0.61: Q9.D 109.86,12.7 109.22,13.34 109.22,17.14 R16.1
  Bottom 0.61: TP14.P$1 76.2,25.4 106.68,25.4 107.95,24.13 R16.1
N$27
  Top 0.61: Q8.G 107.31,8.89 D8.K | R14.1 99.06,17.14 99.06,14.61 Q7.D
  Bottom 0.61: Q9.G Q8.G 104.78,13.97 103.5,12.7 Q7.D
N$28
  Bottom 0.61: D9.A 119.38,6.35 120.65,5.08 122.56,5.08 R21.1
N$29
  Top 0.61: R19.1 120.65,19.68 120.65,14.61 Q11.D
  Bottom 0.61: TP15.P$1 127.64,7.62 Q11.D
N$30
  Top 0.61: Q12.D 126.36,12.7 125.73,13.34 125.73,17.14 R20.1
  Bottom 0.61: TP16.P$1 82.55,26.67 123.19,26.67 124.46,25.4 R20.1
N$31
  Top 0.61: Q11.G 123.83,8.89 D9.K | R18.1 115.57,17.14 115.57,14.61 Q10.D
  Bottom 0.61: Q12.G Q11.G 121.28,13.97 120.02,12.7 Q10.D
N$32
  Bottom 0.61: D10.A 135.89,6.35 137.16,5.08 139.06,5.08 R25.1
N$33
  Top 0.61: R23.1 137.16,19.68 137.16,14.61 Q14.D
  Bottom 0.61: TP17.P$1 143.51,8.26 Q14.D
N$34
  Top 0.61: Q15.D 142.88,12.7 142.24,13.34 142.24,17.14 R24.1
  Bottom 0.61: TP18.P$1 90.17,27.94 139.7,27.94 140.97,26.67 R24.1
N$35
  Top 0.61: Q14.G 140.34,8.89 D10.K | R22.1 132.08,17.14 132.08,14.61 Q13.D
  Bottom 0.61: Q15.G Q14.G 137.79,13.97 136.53,12.7 Q13.D
N$36
  Bottom 0.61: D12.C D13.A
N$44
  Bottom 0.406: J6.19 81.28,72.39 92.71,72.39 96.52,68.58 TP34.P$1
N$45
  Bottom 0.406: J6.18 78.74,74.93 78.74,72.39 80.01,71.12 91.44,71.12 92.71,69.85 TP33.P$1
N$46
  Bottom 0.406: J6.17 77.47,71.12 78.74,69.85 87.63,69.85 88.9,68.58 TP32.P$1
N$47
  Bottom 0.406: J6.16 76.2,74.93 76.2,69.85 77.47,68.58 83.82,68.58 85.09,67.31 TP31.P$1
N$48
  Bottom 0.406: J6.15 74.93,68.58 76.2,67.31 80.01,67.31 81.28,66.04 TP30.P$1
N$49
  Bottom 0.406: J6.14 73.66,74.93 73.66,67.31 74.93,66.04 76.2,66.04 77.47,64.77 TP29.P$1
N$53
  Bottom 0.61: D13.C D14.A
N$54
  Top 0.406: TP35.P$1 38.73,52.7 37.47,53.98 37.47,72.39 50.16,85.09 50.16,91.44 J7.2
N$55
  Top 0.406: TP36.P$1 43.18,54.61 41.27,56.52 41.27,73.66 51.44,83.82 J7.3
N$56
  Top 0.406: TP37.P$1 46.99,54.61 45.09,56.52 45.09,74.93 52.7,82.55 52.7,91.44 J7.4
N$57
  Top 0.406: TP38.P$1 50.8,54.61 48.9,56.52 48.9,75.56 53.98,80.64 J7.5
N$58
  Top 0.406: TP39.P$1 54.61,54.61 52.7,56.52 52.7,76.83 55.24,79.38 55.24,91.44 J7.6
N$59
  Top 0.406: TP40.P$1 58.42,54.61 56.52,56.52 56.52,71.12 55.24,72.39 55.24,77.47 56.52,78.74 J7.7
N$60
  Top 0.406: TP41.P$1 61.59,52.7 60.33,53.98 60.33,70.48 58.42,72.39 58.42,81.28 57.78,81.92 57.78,91.44 J7.8
N$61
  Top 0.406: J7.19 71.75,89.53 73.03,88.27 86.36,88.27 87.63,87 87.63,70.48 94.61,63.5 94.61,53.98 95.89,52.7 TP50.P$1
N$62
  Top 0.406: TP49.P$1 92.08,52.7 90.81,53.98 90.81,63.5 86.36,67.94 86.36,85.72 85.09,87 71.75,87 70.48,88.27 70.48,91.44 J7.18
N$63
  Top 0.406: TP48.P$1 88.27,52.7 87,53.98 87,63.5 85.09,65.41 85.09,84.45 83.82,85.72 70.48,85.72 69.22,87 J7.17
N$64
  Top 0.406: TP47.P$1 84.45,52.7 83.19,53.98 83.19,83.19 81.92,84.45 69.22,84.45 67.94,85.72 67.94,91.44 J7.16
N$65
  Top 0.406: TP46.P$1 80.64,52.7 79.38,53.98 79.38,67.31 78.74,67.94 78.74,81.92 77.47,83.19 67.94,83.19 66.67,84.45 J7.15
N$66
  Top 0.406: TP45.P$1 76.83,52.7 75.56,53.98 75.56,69.85 73.66,71.75 73.66,80.64 72.39,81.92 66.67,81.92 65.41,83.19 65.41,91.44 J7.14
N$67
  Top 0.406: TP44.P$1 73.66,54.61 71.75,56.52 71.75,71.12 71.12,71.75 71.12,79.38 69.85,80.64 65.41,80.64 64.14,81.92 J7.13
N$68
  Top 0.406: TP43.P$1 69.22,52.7 67.94,53.98 67.94,69.85 66.04,71.75 66.04,78.11 62.87,81.28 62.87,91.44 J7.12
N$69
  Top 0.406: TP42.P$1 66.04,54.61 64.14,56.52 64.14,71.12 63.5,71.75 63.5,78.74 59.05,83.19 J7.9
N$70
  Bottom 0.61: D14.C D15.A
N$75
  Bottom 0.406: J8.6 128.27,74.93 128.27,66.04 127,64.77 120.65,64.77 119.38,63.5 TP55.P$1
N$76
  Bottom 0.406: J8.7 129.54,64.77 128.27,63.5 124.46,63.5 123.19,62.23 TP56.P$1
N$77
  Bottom 0.406: J8.8 130.81,74.93 130.81,63.5 127,59.69 TP57.P$1
N$78
  Bottom 0.406: J8.19 144.78,69.85 146.05,68.58 160.02,68.58 161.29,67.31 TP66.P$1
N$79
  Bottom 0.406: J8.18 143.51,74.93 143.51,68.58 144.78,67.31 156.21,67.31 157.48,66.04 TP65.P$1
N$80
  Bottom 0.406: J8.17 142.24,67.31 143.51,66.04 152.4,66.04 153.67,64.77 TP64.P$1
N$81
  Bottom 0.406: J8.16 140.97,74.93 140.97,66.04 142.24,64.77 148.59,64.77 149.86,63.5 TP63.P$1
N$82
  Bottom 0.406: J8.15 139.7,64.77 140.97,63.5 144.78,63.5 146.05,62.23 TP62.P$1
N$83
  Bottom 0.406: J8.14 138.43,74.93 138.43,63.5 142.24,59.69 TP61.P$1
N$84
  Bottom 0.406: J8.13 137.16,61.59 138.43,60.33 TP60.P$1
N$85
  Bottom 0.406: J8.12 135.89,74.93 135.89,61.59 134.62,60.33 TP59.P$1
N$86
  Bottom 0.406: J8.9 132.08,59.05 TP58.P$1
N$87
  Bottom 0.61: PP11.1 32.38,85.09 D15.C
N$92
  Top 0.406: J9.6 120.02,91.44 120.02,64.14 117.47,61.59 117.47,54.61 TP71.P$1
N$93
  Top 0.406: J9.7 121.28,79.38 120.65,78.74 120.65,68.58 121.28,67.94 121.28,54.61 TP72.P$1
N$94
  Top 0.406: J9.8 122.56,91.44 122.56,88.9 123.19,88.27 123.19,72.39 125.09,70.48 125.09,54.61 TP73.P$1
N$95
  Top 0.406: TP82.P$1 159.38,54.61 159.38,67.94 151.76,75.56 151.76,81.28 150.5,82.55 144.15,82.55 J9.19
N$96
  Top 0.406: J9.18 135.25,91.44 135.25,88.9 142.88,81.28 149.22,81.28 150.5,80.01 150.5,74.93 155.57,69.85 155.57,54.61 TP81.P$1
N$97
  Top 0.406: J9.17 133.99,88.27 142.24,80.01 147.96,80.01 149.22,78.74 149.22,74.3 151.76,71.75 151.76,54.61 TP80.P$1
N$98
  Top 0.406: J9.16 132.72,91.44 132.72,87.63 141.6,78.74 146.69,78.74 147.96,77.47 147.96,54.61 TP79.P$1
N$99
  Top 0.406: J9.15 131.44,87 138.43,80.01 138.43,66.67 144.15,60.96 144.15,54.61 TP78.P$1
N$100
  Top 0.406: J9.14 130.18,91.44 130.18,85.72 135.89,80.01 135.89,65.41 140.34,60.96 140.34,54.61 TP77.P$1
N$101
  Top 0.406: J9.13 128.91,84.45 133.35,80.01 133.35,64.14 136.53,60.96 136.53,54.61 TP76.P$1
N$102
  Top 0.406: J9.12 127.64,91.44 127.64,78.11 128.27,77.47 128.27,71.75 132.72,67.31 132.72,54.61 TP75.P$1
N$103
  Top 0.406: J9.9 125.73,88.27 125.73,71.75 128.91,68.58 128.91,54.61 TP74.P$1

### Text on the board
tPlace: DOWN / OUT | UP / OUT | 7V | 5V | Gnd | DOWN / IN | UP / IN | A | B | C | 4 | 5 | 6 | 7 | 8 | 9 | A | B | C | D | E | F | 0 | 1 | 2 | 3 | 4 | 5 | 6 | 7 | 8 | 9 | A | B | C | D | E | F | SERVICES_1 | James Newman | D | E | 5V_E | 5V_D | 5V_C | 5V_B | 5V_A | 7V | RESET | CLK1 | CLK2
bPlace: 0 | 1 | 2 | 3 | 4 | 5 | 6 | 7 | 8 | 9 | A | B | C | D | E | F | 4 | 5 | 6 | 7 | 8 | 9 | A | B | C | D | E | F